# EAGLE design verysmall-2018-sch (EAGLE 7.7.0)
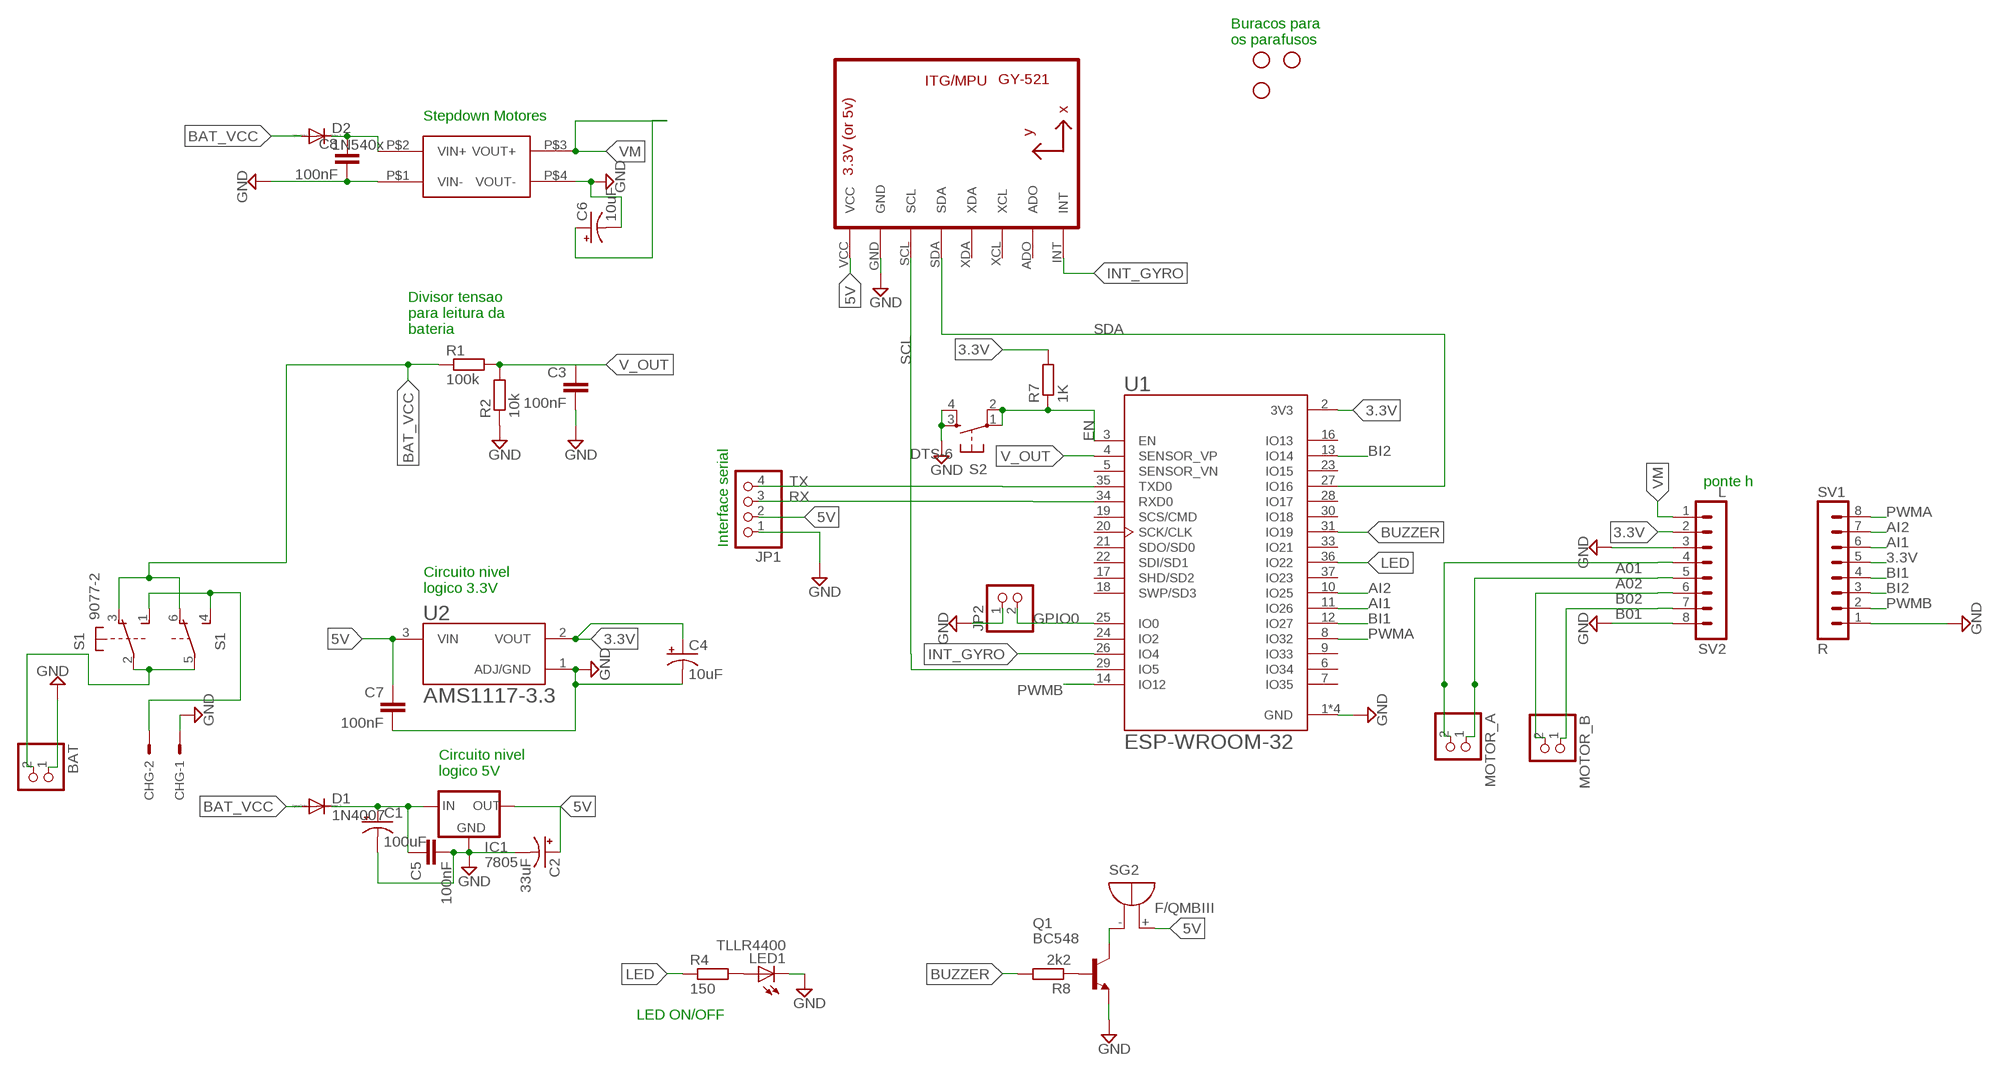
[diagram p0: schematic, sheet 1]

## Parts
BAT  PINHD-1X2  [1X02]
C1  100uF  CPOL-USE2-5  [E2-5]
C2  33uF  CPOL-USE2-5  [E2-5]
C3  100nF  22PF-PTH-2.54MM-200V-5%  [CAP-PTH-2.54]
C4  10uF  CPOL-USE2-5  [E2-5]
C5  100nF  22PF-PTH-2.54MM-200V-5%  [CAP-PTH-2.54]
C6  10uF  CPOL-USE2-5  [E2-5]
C7  100nF  22PF-PTH-2.54MM-200V-5%  [CAP-PTH-2.54]
C8  100nF  22PF-PTH-2.54MM-200V-5%  [CAP-PTH-2.54]
CHG  KK-156-2  [KK-156-2]
D1  1N4007  DIODE-D-7.5  [D-7.5]
D2  1N540x  1N5400  [DO201-15]
H1  STAND-OFF  [STAND-OFF]
H2  STAND-OFF  [STAND-OFF]
H3  STAND-OFF  [STAND-OFF]
IC1  7805  78XXL  [78XXL]
JP1  PINHD-1X4  [1X04]
JP2  PINHD-1X2  [1X02]
LED1  TLLR4400  [LED3MM]
MOTOR_A  PINHD-1X2  [1X02]
MOTOR_B  PINHD-1X2  [1X02]
Q1  BC548  [TO92-EBC]
R1  100k  R-EU_0204/7  [0204/7]
R2  10k  R-EU_0204/7  [0204/7]
R4  150  R-EU_0207/7  [0207/7]
R7  1K  R-EU_0204/7  [0204/7]
R8  2k2  R-EU_0204/7  [0204/7]
S1  9077-2  [9077-2]
S2  DTS-6  [DTS-6]
SG2  F/QMBIII  [F/QMBIII]
SV1  R  MA08-1  [MA08-1]
SV2  L  MA08-1  [MA08-1]
U1  ESP-WROOM-32  [MODULE_ESP-WROOM-32]
U2  AMS1117-3.3  [SOT229P700X180-4N]
U3  GY-521MPU6050  [GY-521]
U$1  MP1584-MINI-SMD  [MINI-DC-BRICK-SMD]

## Nets
3.3V: C4.+ R7.2 SV1.5 SV2.2 U1.2(3V3) U2.2(VOUT)
5V: C2.+ C7.1 IC1.OUT JP1.2 SG2.+(-) U2.3(VIN) U3.VCC
A01: MOTOR_A.2 SV2.4
A02: MOTOR_A.1 SV2.5
AI1: SV1.6 U1.11(IO26)
AI2: SV1.7 U1.10(IO25)
B01: MOTOR_B.1 SV2.7
B02: MOTOR_B.2 SV2.6
BAT_VCC: D1.A D2.A R1.1 S1.3(1:O) S1.6(2:O)
BI1: SV1.4 U1.12(IO27)
BI2: SV1.3 U1.13(IO14)
BUZZER: R8.2 U1.31(IO19)
EN: R7.1 S2.1 S2.2 U1.3(EN)
GND: BAT.1 C1.- C2.- C3.2 C4.- C5.2 C6.- C7.2 C8.2 CHG.1 IC1.GND JP1.1 JP2.1 LED1.K(C) Q1.E R2.1 S2.3 S2.4 SV1.1 SV2.3 SV2.8 U1.1(GND) U1.1.1(GND) U1.15(GND) U1.38(GND) U2.1(ADJ/GND) U3.GND U$1.P$1(VIN-) U$1.P$4(VOUT-)
GPIO0: JP2.2 U1.25(IO0)
INT_GYRO: U1.26(IO4) U3.INT
LED: R4.1 U1.36(IO22)
N$1: C8.1 D2.C U$1.P$2(VIN+)
N$5: LED1.A R4.2
N$6: CHG.2 S1.1(1:S) S1.4(2:S)
N$7: C3.1
N$8: BAT.2 S1.2(1:P) S1.5(2:P)
N$10: Q1.C SG2.-(+)
N$13: C1.+ C5.1 D1.C IC1.IN
N$14: Q1.B R8.1
PWMA: SV1.8 U1.8(IO32)
PWMB: SV1.2 U1.14(IO12)
RX: JP1.3 U1.34(RXD0)
SCL: U1.29(IO5) U3.SCL
SDA: U1.27(IO16) U3.SDA
TX: JP1.4 U1.35(TXD0)
V_OUT: R1.2 R2.2 U1.4(SENSOR_VP)
VM: C6.+ SV2.1 U$1.P$3(VOUT+)
Unconnected: U1.5(SENSOR_VN) U1.6(IO34) U1.7(IO35) U1.9(IO33) U1.16(IO13) U1.17(SHD/SD2) U1.18(SWP/SD3) U1.19(SCS/CMD) U1.20(SCK/CLK) U1.21(SDO/SD0) U1.22(SDI/SD1) U1.23(IO15) U1.24(IO2) U1.28(IO17) U1.30(IO18) U1.33(IO21) U1.37(IO23) U3.ADO U3.XCL U3.XDA

## Notes on the sheet
- Buracos para
  os parafusos
- Stepdown Motores
- Divisor tensao
  para leitura da 
  bateria
- ponte h
- Interface serial
- Circuito nivel
  logico 3.3V
- Circuito nivel
  logico 5V
- LED ON/OFF

## Library data of the parts
BAT JP2 MOTOR_A MOTOR_B = pinhead:PINHD-1X2: PIN HEADER
C1 C2 C4 C6 = rcl:CPOL-US: POLARIZED CAPACITOR, American symbol; SPICEPREFIX: C
C3 C5 C7 C8 = SparkFun-Capacitors:22PF: 22pF ceramic capacitors A capacitor is a passive two-terminal electrical component used to store electrical energy temporarily in an electric field.; PROD_ID: CAP-09128; VALUE: 22pF
CHG = con-molex:KK-156-2: KK 156 HEADER Source: http://www.molex.com/pdm_docs/sd/026604100_sd.pdf; MF: MOLEX; OC_FARNELL: unknown; OC_NEWARK: unknown
D1 = diode:DIODE-: DIODE
D2 = diode:1N5400: DIODE standard rectifier, 3 A, 50 V (Motorola)
H1-H3 = SparkFun-Hardware:STAND-OFF: Stand Off Drill holes for mechanically mounting via screws, standoffs, etc. Note: Use the keepout ring to avoid running the screw head into surrounding components. Variant Overviews STAND-OFF - Mechanical footprint for a #4 phillips button head screw. STAND-OFF-TIGHT - Mechanical footprint for a #4 phillips button head screw, Example SparkFun Products Screw - Phillips Head (1/4", 4-40, 10 pack) <https://www.sparkfun.com/products/10453> (PRT-10453) Screw - Phillips Head (1/2", 4-40, 10 pack) <https://www.sparkfun.com/products/10452> (PRT-10452) Screw - Phillips Head (3/4", 4-40, 10 pack) <https://www.sparkfun.com/products/10451> (PRT-10451) Screw - Phillips Head (1", 4-40, 10 pack) <https://www.sparkfun.com/products/10450> (PRT-10450)
IC1 = v-reg:78XXL: VOLTAGE REGULATOR
JP1 = pinhead:PINHD-1X4: PIN HEADER
LED1 = led:TLLR4400: Low Current (2mA) LED 3 mm Tinted Diffused Package color RED Source: Data sheet <http://www.farnell.com/datasheets/391100.pdf>; MF: VISHAY SEMICONDUCTOR; OC_FARNELL: 1612437
Q1 = transistor-npn:BC548*: NPN Transistor
R1 R2 R4 R7 R8 = rcl:R-EU_: RESISTOR, European symbol; SPICEPREFIX: R
S1 = switch-misc:9077-2: MARQUARDT SWITCH 9077.0200 Distributor: Buerklin <https://www.buerklin.com/default.asp?event=ShowArtikel%2812G2822%29&l=d&jump=ArtNr_12G2822>
S2 = switch-tact:DTS-6
SG2 = buzzer:F/QMBIII: BUZZER Source: Buerklin; OC_FARNELL: unknown; OC_NEWARK: unknown
SV1 SV2 = con-lstb:MA08-1: PIN HEADER; OC_FARNELL: unknown; OC_NEWARK: unknown
U1 = ESP-WROOM-32:ESP-WROOM-32: Module: combo; GPIO, I2C x2, I2S x2, SDIO, SPI x3, UART x3; 19.5dBm; AVAILABILITY: Unavailable; DESCRIPTION: Module: combo; GPIO, I2C x2, I2S x2, SDIO, SPI x3, UART x3; 19.5dBm; MF: Olimex LTD; MP: ESP-WROOM-32; PACKAGE: Module Espressif Systems; PRICE: None
U2 = AMS1117-3.3:AMS1117-3.3: Sot223/Pkg 1-Amp 3.3-Volt Low Drop Out Voltage Regulatator; AVAILABILITY: Unavailable; DESCRIPTION: Sot223/Pkg 1-Amp 3.3-Volt Low Drop Out Voltage Regulatator; MF: Advanced Monolithic Systems; MP: AMS1117-3.3; PACKAGE: None; PRICE: None
U3 = gy-521:GY-521
U$1 = MP1584-dc-brick:MP1584-MINI-SMD

## Board
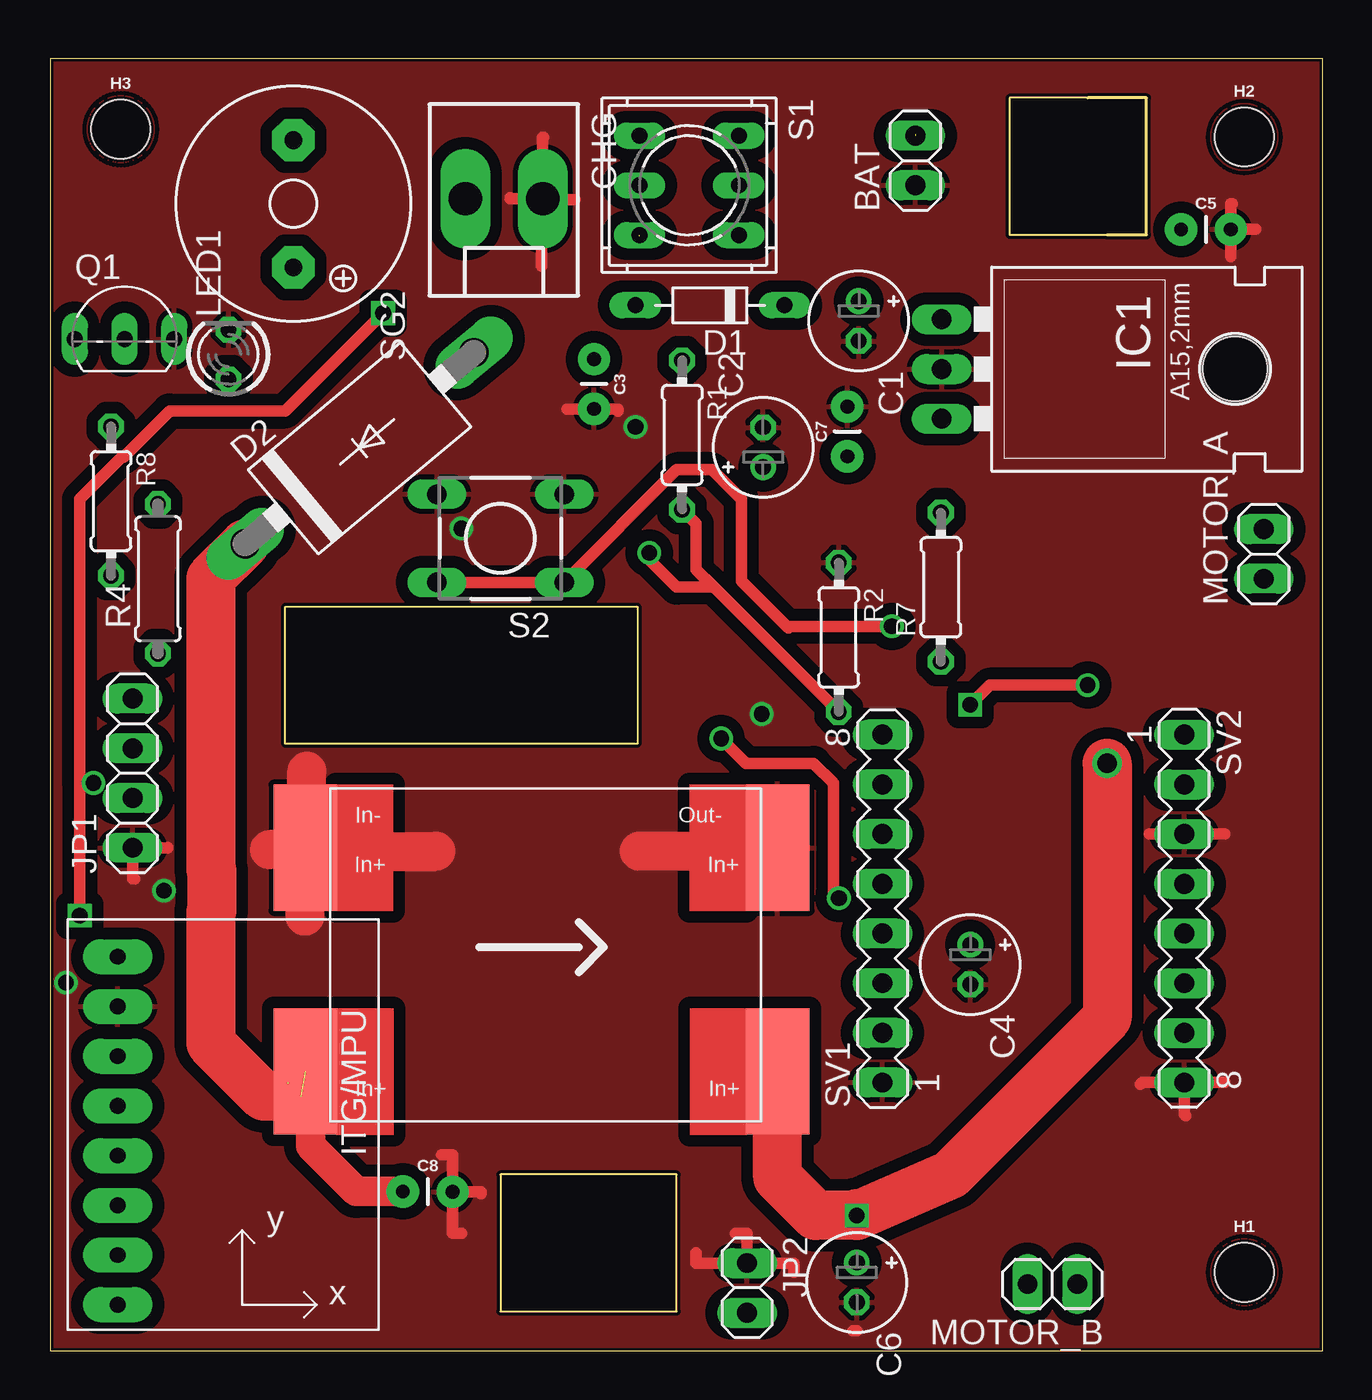
[diagram p1: board, top side]
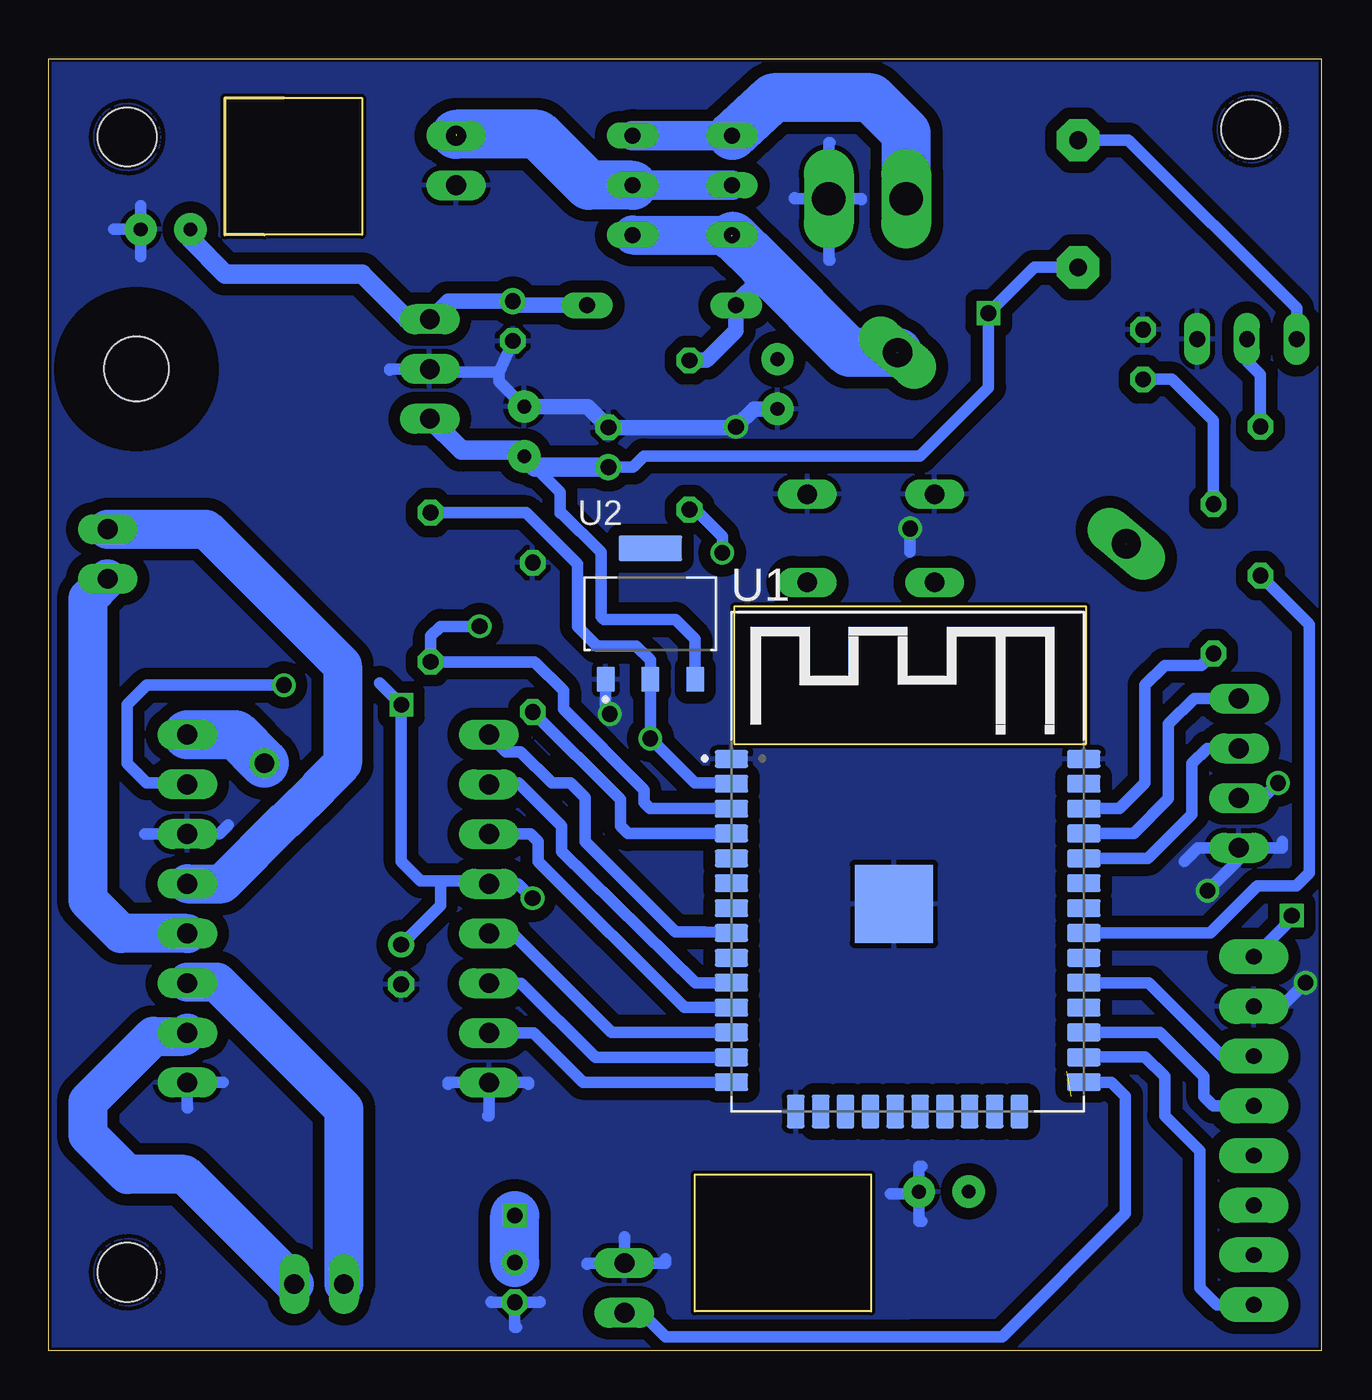
[diagram p2: board, bottom side, seen from below]

Size 65 x 66 mm. Coordinates in mm from the lower left corner, seen from the top.
Outline: 54,64 53,64
Outline: 53,64 49,64 49,57 54,57 56,57 56,64 53,64
Outline: 0,0 65,0 65,66 0,66 0,0
Outline: 12,31 12,38 30,38 30,31 12,31
Outline: 23,9 23,2 32,2 32,9 23,9
Copper layers (1*16): Top 0.035mm / dielectric 1.5mm / Bottom 0.035mm
Design rules "default *": minimum track width 0.6mm, minimum drill 0.35mm, track to track 0.6mm, track to pad 0.6mm, pad to pad 0.6mm, via to via 0.6mm, smd to smd 0.6mm, copper to edge 6mil, drill to drill 6mil, minimum pad ring 10mil, minimum via ring 8mil, stop-mask expansion 4mil, vias tented up to drill 0mil, thermal gap 10mil
tRestrict: area 23,2 to 32,9; area 49,57 to 56,64
bRestrict: area 23,2 to 32,9; area 49,57 to 56,64

### Footprints (pad centres in the part's own frame; a part is rotated, then mirrored left to right if it is on the bottom)
1X02 = drill 1.016 long: 1 -1.27,0; 2 1.27,0
E2-5 = drill 0.813 pad 1.27: + -1.016,0 | drill 0.813 pad 1.27 octagon: - 1.016,0
CAP-PTH-2.54 = drill 0.7 pad 1.651: 1 -1.27,0; 2 1.27,0
KK-156-2 = drill 1.7 pad 2.184 long: 1 -1.98,0; 2 1.98,0
D-7.5 = drill 0.813 long: A 3.81,0; C -3.81,0
DO201-15 = drill 1.499 long: A 7.62,0; C -7.62,0
STAND-OFF = hole 3: 0,0
78XXL = drill 1.016 long: GND 0,-3.81; IN -2.54,-3.81; OUT 2.54,-3.81 | hole 3.302: 0,11.176
1X04 = drill 1.016 long: 1 -3.81,0; 2 -1.27,0; 3 1.27,0; 4 3.81,0
LED3MM = drill 0.813 octagon: A -1.27,0; K 1.27,0
TO92-EBC = drill 0.813 long: B 0,-1.27; C -2.54,-1.27; E 2.54,-1.27
0204/7 = drill 0.813 octagon: 1 -3.81,0; 2 3.81,0
0207/7 = drill 0.813 octagon: 1 -3.81,0; 2 3.81,0
9077-2 = drill 0.813 long: 1 -2.54,2.54; 2 0,2.54; 3 2.54,2.54; 4 -2.54,-2.54; 5 0,-2.54; 6 2.54,-2.54
DTS-6 = drill 1 long: 1 -3.25,2.25; 2 3.25,2.25; 3 -3.25,-2.25; 4 3.25,-2.25
F/QMBIII = drill 0.914 pad 2.159 octagon: + 3.251,0; - -3.251,0
MA08-1 = drill 1.016 long: 1 -8.89,0; 2 -6.35,0; 3 -3.81,0; 4 -1.27,0; 5 1.27,0; 6 3.81,0; 7 6.35,0; 8 8.89,0
MODULE_ESP-WROOM-32 = smd 1.7 x 0.9: 1 -9,8.255; 2 -9,6.985; 3 -9,5.715; 4 -9,4.445; 5 -9,3.175; 6 -9,1.905; 7 -9,0.635; 8 -9,-0.635; 9 -9,-1.905; 10 -9,-3.175; 11 -9,-4.445; 12 -9,-5.715; 13 -9,-6.985; 14 -9,-8.255; 25 9,-8.255; 26 9,-6.985; 27 9,-5.715; 28 9,-4.445; 29 9,-3.175; 30 9,-1.905; 31 9,-0.635; 32 9,0.635; 33 9,1.905; 34 9,3.175; 35 9,4.445; 36 9,5.715; 37 9,6.985; 38 9,8.255 | smd 4 x 4: 1.1 -0.7,0.845 | smd 0.9 x 1.7: 15 -5.715,-9.755; 16 -4.445,-9.755; 17 -3.175,-9.755; 18 -1.905,-9.755; 19 -0.635,-9.755; 20 0.635,-9.755; 21 1.905,-9.755; 22 3.175,-9.755; 23 4.445,-9.755; 24 5.715,-9.755
SOT229P700X180-4N = smd 0.93 x 1.31: 1 -2.29,-3.345; 2 0,-3.345; 3 2.29,-3.345 | smd 3.24 x 1.31: 4 0,3.345
GY-521 = drill 0.8 pad 1.778 long: ADO -8.89,-6.35; GND -8.89,6.35; INT -8.89,-8.89; SCL -8.89,3.81; SDA -8.89,1.27; VCC -8.89,8.89; XCL -8.89,-3.81; XDA -8.89,-1.27
MINI-DC-BRICK-SMD = smd 3.251 x 6.452: P$1 -11.43,5.08; P$2 -11.43,-6.35; P$3 12.7,-6.35; P$4 12.7,5.08

### Placement (x,y rotation side)
BAT  44.2,60.8 90 top
C1  41.3,52.6 270 top
C2  36.42,46.15 90 top
C3  27.78,49.38 270 top
C4  47,19.72 270 top
C5  59.04,57.28 0 top
C6  41.2,3.48 270 top
C7  40.72,46.96 90 top
C8  19.28,8.12 359.6 top
CHG  23.18,58.85 180 top
D1  33.7,53.4 180 top
D2  15.8,46.1 39.9 top
H1  61,4 0 top
H2  61,62 0 top
H3  3.6,62.4 0 top
IC1  49.35,50.15 270 top
JP1  4.2,29.5 90 top
JP2  35.6,3.2 270 top
LED1  9.1,50.89 90 top
MOTOR_A  62,40.7 90 top
MOTOR_B  51.2,3.4 180 top
Q1  3.79,52.95 0 top
R1  32.28,46.78 270 top
R2  40.28,36.44 270 top
R4  5.5,39.43 90 top
R7  45.5,39 90 top
R8  3.1,43.4 270 top
S1  32.64,59.53 270 top
S2  23,41.5 180 top
SG2  12.42,58.59 270 top
SV1  42.52,22.58 90 top
SV2  57.93,22.58 270 top
U1  21.13,21.97 0 bottom
U2  34.27,37.64 0 bottom
U3  12.33,11.23 0 top
U$1  24.46,20.61 0 top

### Tracks (layer width: path | path; a pad name or v marks a point on that pad's centre or on a via)
3.3V  (via drill 0.8)
  Top 0.6: v53,34 48,34 v47,33 | v34.27,31.27 35.54,30 39,30 40,29 40,23.4 v40.29,23.11
  Bottom 0.6: U1.2 30.18,29 32,29 v34.27,31.27 U2.2 34.27,35.27 35,36 35.91,36 | 48.1,34.1 v47,33 47,25 46,24 45,24 | 44,24 42.67,24 SV1.5 41.04,23.85 v40.29,23.11 | 44,24 45,24 | SV2.2 58,29 60,29 61,30 61,33 60,34 v53,34 | 35.91,36 37,36 38,37 38,40.18 40.63,42.81 R7.2 | 35.91,36 | 44,24 | 45,24 45,22.74 C4.+
5V  (via drill 0.8)
  Top 0.6: 1.5,29 v1.5,22.23 | v2.2,29 1.5,29 | 1.5,29 1.5,43.5 3.65,45.65 3.75,45.65 6.1,48 12,48 v17,53
  Bottom 0.6: JP1.2 2.97,28.23 v2.2,29 | C7.1 38.9,43.87 38.9,42.8 38.8,42.8 36.8,40.8 36.8,37.5 36.65,37.35 33,37.35 32,36.35 32,34.31 U2.3 | U3.VCC 1.5,22.06 v1.5,22.23 | C2.+ 35.17,45.13 34.6,45.7 30.53,45.7 30.52,45.7 20.5,45.7 20.1,46.1 | 20.1,46.1 19.8,46.4 | 20.1,46.1 17,49.2 v17,53 14.66,55.34 SG2.+
  Bottom 1: C2.+ 40.16,45.13 C7.1 41.03,46 43.93,46 IC1.OUT
A01
  Bottom 2: SV2.4 56.15,23.85 52.85,27.15 52.82,27.15 51.15,28.82 51.15,28.85 50,30 50,35 56.97,41.97 MOTOR_A.2
A02
  Bottom 2: SV2.5 61.31,21.31 63,23 63,38.43 MOTOR_A.1
AI1
  Bottom 0.6: U1.11 32.52,17.52 40,25 40,26 40.39,26.39 SV1.6
AI2
  Bottom 0.6: SV1.7 42.45,29 41,29 38.8,26.8 38.8,25.5 31.96,18.8 U1.10
B01
  Bottom 2: SV2.7 58.11,16.05 59.67,16.05 63,12.72 63,11 61,9 58.07,9 MOTOR_B.1
B02
  Bottom 0.6: SV2.6 58,19 57.93,18.83
  Bottom 2: 51.06,13.46 56.43,18.83 57.93,18.83 | 51.06,13.46 | 51.06,13.46 50,12.4 | MOTOR_B.2 49.93,12.33 51.06,13.46
BAT_VCC  (2 unrouted)
  Bottom 0.8: R1.1 31.41,50.59 | 31.41,50.59 | 31.41,50.59 29.89,52.11 D1.A
  Bottom 1: 28.55,54.73 28.55,55.44 28.55,54.73 | 28.55,54.73 D1.A
  Bottom 2: S1.3 S1.6
  Bottom 2.5: D2.A 24.1,50.99 28.55,55.44 30.04,56.93 30.1,56.93
BI1
  Bottom 0.6: U1.12 36.26,16.26 41.31,21.31 SV1.4
BI2
  Bottom 0.6: U1.13 37.09,14.98 40.87,18.77 SV1.3
BUZZER
  Bottom 0.6: 12.02,21.23 U1.31 5.67,21.34 3.27,23.73 2,23.73 | R8.2 0.6,37.09 0.6,24.4 1.27,23.73 2,23.73 | 2,23.73 2.48,23.73
EN  (via drill 0.8)
  Top 0.6: S2.2 S2.1 32,45 33.8,45 35.3,43.5 35.3,39.31 37.7,36.9 37.8,37 v43,37
  Bottom 0.6: U1.3 34.28,27.69 34.6,28 34.6,28.65 38.72,32.77 38.72,33.72 40.19,35.19 R7.1 45.5,36.5 45,37 v43,37
GND  (via drill 0.8)
  Top 0.6: SV2.8 57.93,12.07 58,12 | SV2.8 59.99,13.69 60,13.7 | SV2.8 55.79,13.69 55.7,13.6 | 60,26.4 arc-90 59.99,26.39 SV2.3 56.15,26.39 56.15,26.4 | 41.2,1 41,1 | JP2.1 35.6,6 35,6 | JP2.1 33,4.47 33,5 | JP2.1 38,4.47 38,4 | C8.2 20.55,10 20,10 | C8.2 20.55,6 21,6 | C8.2 22,8.11 22,8 | 4.3,24.1 4.2,24.1 JP1.1 6,25.69 6,25.7 | 29,48 29,48.11 C3.2 26.4,48.1 | CHG.1 25.16,62 25.2,62 | CHG.1 25.16,58.8 26.8,58.8 | CHG.1 25.1,58.85 25.1,55.4 | CHG.1 23.5,58.85 23.5,58.9 | C5.2 61.6,57.28 61.6,57.3 | C5.2 60.31,58.6 60.4,58.6 | C5.2 60.3,55.9
  Top 1.5: U$1.P$4 37,25.53
  Top 2: U$1.P$1 arc-90 12.94,25.6 11.2,25.6 | U$1.P$1 arc90 13,25.66 13,22.2 | U$1.P$1 arc90 13.1,25.76 13.1,29.6 | U$1.P$4 arc-90 36.97,25.5 30.1,25.5 | U$1.P$1 arc90 13.22,25.5 19.7,25.5
  Bottom 0.6: 21,40.8 v21,42 | C1.- 42,50 | 42,50 45.54,50 IC1.GND 47.6,50.15 47.6,50.1 | 42,50 42,49.51 C7.2 | U2.1 36.56,32.73 v36.35,32.52 | v5.8,23.5 4.2,25.1 JP1.1 | CHG.1 25.16,61.7 25.1,61.7 | CHG.1 25.16,55.7 25.1,55.7 | CHG.1 26.9,58.85 26.9,58.9 | CHG.1 23.5,58.85 23.5,58.8 | C5.2 61.7,57.28 61.7,57.3 | C5.2 60.3,58.5 | C5.2 60.31,55.9 60.3,55.9 | 60.1,26.4 60.1,26.39 SV2.3 56.3,26.39 55.84,26.84 | 57.9,12.4 57.93,12.4 SV2.8 56.1,13.7 | JP2.1 35.6,5.8 | JP2.1 37.5,4.47 37.5,4.4 | JP2.1 33.5,4.47 33.5,4.7 | C6.- 42.4,2.46 42.4,2.5 | C6.- 41.2,1.2 41.1,1.2 | C6.- 39.9,2.46 39.9,2.5 | C8.2 20.55,9.4 20.4,9.4 | C8.2 20.55,8 22,8 | C8.2 20.55,6.6 20.4,6.6 | SV1.1 44.6,13.69 44.6,13.6 | SV1.1 40.5,13.69 40.5,13.6 | SV1.1 42.52,12 42.6,12 | JP1.1 2,25.69 2,26 | JP1.1 6.31,25.69 7,25 | U3.GND 2.02,17.58 v0.8,18.8
  Bottom 0.8: C7.2 37.48,48.23 C2.- 29.93,47.17 v29.9,47.2 28.99,48.11 C3.2
  pour Bottom: 0,66 65,66 65,0 0,0
  pour Top: 0,66 65,66 65,0 0,0
GPIO0  (1 unrouted)
  Bottom 0.6: 11.63,13.63 12.13,13.63 | JP2.2 34.73,1.93 33.5,0.7 21,0.7 | 21,0.7 20.3,0.7 | U1.25 10.71,13.72 10,13 10,7 16.3,0.7 21,0.7
INT_GYRO
  Bottom 0.6: U3.INT 5.34,2.34 6.2,3.2 6.2,10.2 8,12 8,14 9,15 12.12,15 U1.26
LED
  Bottom 0.6: U1.36 10.31,27.69 9,29 9,34 8,35 6.12,35 R4.1
N$1  (2 unrouted)
  Top 1.5: 12.79,13 13.29,12.5 13.29,10.47 15.63,8.13 C8.1
  Top 2.5: D2.C 8.2,39.46 8.2,24.57 8.25,24.52 8.25,22.48 8.2,22.43 8.2,15.7 10.9,13 12.79,13
N$5
  Bottom 0.6: R4.2 5.5,47.5 7.62,49.62 LED1.A
N$6
  Bottom 0.6: 30,62.25 S1.4 | 29,63.25 28,64
  Bottom 1.5: S1.1 S1.4
  Bottom 2.5: CHG.2 21.2,62.2 23,64 28,64 S1.4
N$7
  Bottom 0.6: 27.88,50.55 C3.1
N$8  (1 unrouted)
  Bottom 0.6: 34,59.5 35.01,59.53 S1.2
  Bottom 1.5: S1.5 35.01,59.53
  Bottom 2.5: S1.2 37.43,59.53 40.04,62.14 44.2,62.14
N$10
  Bottom 0.6: SG2.- 9.84,61.84 1.25,53.25 Q1.C
N$13
  Bottom 0.8: D1.C 41.08,53.4 C1.+ 44.61,53.62 IC1.IN
  Bottom 1: IC1.IN 46.69,52.69 49,55 56,55 57.77,56.77 C5.1
N$14
  Bottom 0.6: R8.1 3.1,49.86 3.79,50.55 Q1.B
PWMA
  Bottom 0.6: SV1.8 41.64,30.59 40.9,30.59 39.3,29 38.35,29 37.6,28.25 37.6,26 33,21.4 31.5,21.4 U1.8
PWMB
  Bottom 0.6: SV1.2 40.23,16.23 37.72,13.72 U1.14
RX
  Bottom 0.6: 11.98,25 U1.34 8.86,25.15 6.6,27.4 6.6,30 5.83,30.77 JP1.3
SCL
  Bottom 0.6: U3.SCL 5.04,15.04 8.79,18.8 U1.29
SDA
  Bottom 0.6: U1.27 11,16.26 10.88,16.26 | 10.88,16.26 10.05,16.26 | U3.SDA 5.5,12.5 6,13 6,14 8.26,16.26 10.88,16.26
TX
  Bottom 0.6: U1.35 9.59,26.41 7.8,28.2 7.8,32 6.49,33.31 JP1.4
V_OUT  (via drill 0.8)
  Top 0.6: R2.2 33.91,39 | 33.91,39 32,39 30.6,40.4 v30.6,40.75 | R1.2 33,42.25 33,39.91 33.91,39
  Bottom 0.6: U1.4 35.41,26.41 35.8,26.8 35.8,28.15 R2.2 | R1.2 31.97,42.97 30.6,41.6 v30.6,40.75
VM  (via drill 0.8, 1)
  Top 2.5: 46,9 54,17 v54,30 | 46,9 | v41.2,6.9 46,9 | 41.2,6.99 v41.2,6.9 | v41.2,6.9 39.1,6.9 | 39.1,6.9 39,7 | 39.1,6.9 37.16,8.84 U$1.P$3
  Bottom 2.5: SV2.1 55.47,31.47 v54,30 | C6.+ v41.2,6.9